# Altium schematic sheet Connectors.SchDoc
size A4; SheetNumber: 2; SheetTotal: 5; SPICEModelCacheIIVRYWVE: <root> / <DocumentId>IIVRYWVE</DocumentId> / <CacheFrame Number="0"> / <Model Name="0805_150080gs75000" Kind="CKT"> / <Text>****** / .subckt 0805_150080GS75000  1  2 / D1 1 2 SMCW / .MODEL SMCW D / + IS=906.98E-12 / + N=4.4982 / + RS=1.5743 / + IKF=518.93E-9 / + CJO=1.0000E-12 / + M=.3333 / + VJ=.75 / + BV=5 / + IBV=10.00E-6 / + TT=5.0000E-9 / .ends</Text> / </Model> / </CacheFrame> / </root>
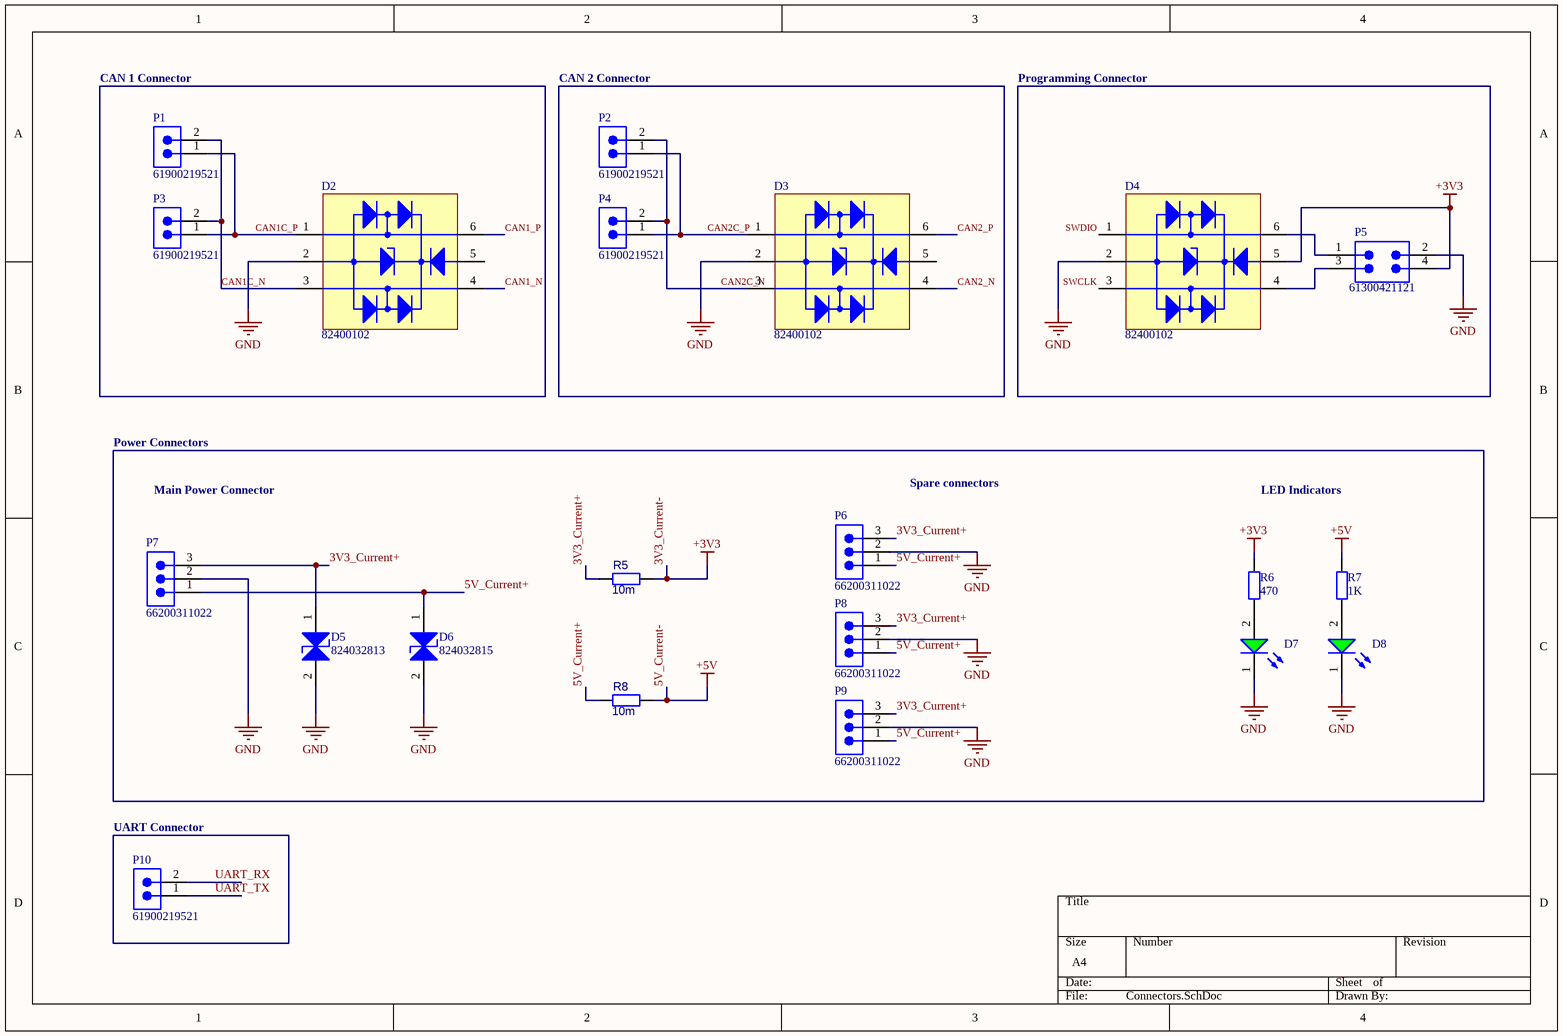
[diagram p0: Connectors.SchDoc]

## Parts
D2  82400102  [WE-TVS_SOT23-6L]
D3  82400102  [WE-TVS_SOT23-6L]
D4  82400102  [WE-TVS_SOT23-6L]
D5  824032813  [WE-TVS_DFN1610-2L]
D6  824032815  [WE-TVS_DFN1610-2L]
D7  150080GS75000  [WL-SMCW_0805_150080xx75000]  (value not drawn)
D8  150080GS75000  [WL-SMCW_0805_150080xx75000]  (value not drawn)
P1  61900219521  [61900219521]
P2  61900219521  [61900219521]
P3  61900219521  [61900219521]
P4  61900219521  [61900219521]
P5  61300421121  [61300421121]
P6  66200311022  [66200311022]
P7  66200311022  [66200311022]
P8  66200311022  [66200311022]
P9  66200311022  [66200311022]
P10  61900219521  [61900219521]
R5  10m  [580070763010-Footprint-1]
R6  value 470  [WRIS-RSKS_0603_Reflow]  (hidden comment: 560112116067)
R7  value 1K  [WRIS-RSKS_0603_Reflow]  (hidden comment: 560112116014)
R8  10m  [580070763010-Footprint-1]

## Blocks framed on the sheet
CAN 1 Connector: D2 P1 P3
CAN 2 Connector: D3 P2 P4
Programming Connector: D4 P5
UART Connector: P10

## Nets
3V3_Current-: D4.5(VDD) P5.4 R5.2 R6.2  [also labelled +3V3]
5V_Current-: R7.2 R8.2  [also labelled +5V]
GND: D2.2(GND) D3.2(GND) D4.2(GND) D5.2(GND) D6.2(GND) D7.1(K) D8.1(K) P5.2 P6.2 P7.2 P8.2 P9.2
3V3_Current+: D5.1(I/O_1) P6.3 P7.3 P8.3 P9.3 R5.1
5V_Current+: D6.1(I/O_1) P6.1 P7.1 P8.1 P9.1 R8.1
CAN1_N: D2.4(I/O_2)
CAN1_P: D2.6(I/O_1)
CAN1C_N: D2.3(I/O_2) P1.2 P3.2
CAN1C_P: D2.1(I/O_1) P1.1 P3.1
CAN2_N: D3.4(I/O_2)
CAN2_P: D3.6(I/O_1)
CAN2C_N: D3.3(I/O_2) P2.2 P4.2
CAN2C_P: D3.1(I/O_1) P2.1 P4.1
SWCLK: D4.3(I/O_2)
SWDIO: D4.1(I/O_1)
UART_RX: P10.2
UART_TX: P10.1
NetD4_4: D4.4(I/O_2) P5.3
NetD4_6: D4.6(I/O_1) P5.1
NetD7_2: D7.2(A) R6.1
NetD8_2: D8.2(A) R7.1

Not connected (* = marked no-connect by the designer): D2 5(VDD); D3 5(VDD)

## Notes on the sheet
- Power Connectors
- Main Power Connector
- Spare connectors
- LED Indicators

## Library data of the parts
D2-D4 = CMP-004-00017-1: WE-TVS TVS Diode – High Speed Series, SOT23-6L, 2+1 Channel, 5V, 2pF; Manufacturer: Wurth Elektronik; Polarity: Unidirectional; Channel ESD Clamping Voltage: 10V; ESD Air Discharge Capability: 15kV; (Reverse) Peak Pulse Current: 7A; (Reverse) Breakdown Voltage: 6V; Channel Reverse Leakage Current: 1uA; ESD Contact Discharge Capability: 8kV; Source: WE-TVS.SchLib; Component Type: Standard; Packaging: Tape and Reel; Height: 1.45mm; Pins: 6; Match Code: WE-TVS; Case/Package: SOT23-6L; Mount: Surface Mount; Channel Operating Voltage: 5V; ComponentLink1Description: Website Link; ComponentLink2URL: https://www.we-online.com/redexpert/spec/82400102?ad; Category: ESD Protection; Channel Input Capacitance: 2pF; Operating Temperature Min: -40°C; ComponentLink1URL: https://www.we-online.com/redexpert/article/82400102?ad; Length: 2.9mm; Width: 2.8mm; Manufacturer Part Number: 82400102; Design Item ID: 82400102; ComponentLink2Description: Datasheet Link; Operating Temperature Max: 125°C; Number of Channels: 2+1
D5 = CMP-03913-133963840-1: 824032813 Tvs Diode, Bidir, 3.3V, Dfn1610 Rohs Compliant: Yes; Width: 1mm; NexarPartId: 133963840; Min Operating Temperature: -55°C; Max Operating Temperature: 125°C; Height: 500µm; Length: 1.6mm; RoHS: Compliant
D6 = CMP-03913-133963841-1: 824032815 Tvs Diode, Bidir, 5V, Dfn1610 Rohs Compliant: Yes; Min Operating Temperature: -55°C; Width: 1mm; NexarPartId: 133963841; Length: 1.6mm; RoHS: Compliant; Max Operating Temperature: 85°C; Height: 500µm
D7 D8 = CMP-004-00452-1: WL-SMCW Mono-color Chip LED Waterclear, SMT, size 0805, Green, 3.2V, 140°; Manufacturer: Wurth Elektronik; Dominant Wavelength: 525nm; Chip Technology: InGaN; Luminous Intensity: 450mcd; Peak Wavelength: 515nm; Viewing Angle: 140°; Source: WL-SMCW.SchLib; Category: Signal LEDs; Design Item ID: 150080GS75000; ComponentLink1URL: https://www.we-online.com/redexpert/article/150080GS75000?ad; Pins: 2; Emitting Color: Green; Mount: Surface Mount; ComponentLink2URL: https://www.we-online.com/redexpert/spec/150080GS75000?ad; Match Code: WL-SMCW; ComponentLink1Description: Website Link; Operating Temperature Max: 85°C; Case/Package: 0805; Manufacturer Part Number: 150080GS75000; Forward Voltage: 3.2V; Operating Temperature Min: -40°C; Component Type: Standard; Height: 0.7mm; Length: 2mm; Width: 1.25mm; Packaging: Tape and Reel; ComponentLink2Description: Datasheet Link
P1-P4 P10 = CMP-002-00288-1: WR-WTB THT Male Right Angled Top Locking Header, pitch 2.54mm, 2pins; Manufacturer: Wurth Elektronik; Working Voltage: 250VAC; Contact Resistance: 20mOhm; Rated Current: 3A; Withstanding Voltage: 1000VAC; Number of Rows: 1; Length: 5.08mm; ComponentLink1URL: https://www.we-online.com/redexpert/article/61900219521?ad; Mount: Through Hole; ComponentLink2Description: Datasheet Link; Pins: 2; Width: 12.47mm; Height: 5.8mm; Component Type: Standard; Orientation: Right Angled Top Locking; Match Code: WR-WTB; Design Item ID: 61900219521; Pitch: 2.54mm; ComponentLink2URL: https://www.we-online.com/redexpert/spec/61900219521?ad; Manufacturer Part Number: 61900219521; ComponentLink1Description: Website Link; Packaging: Bag; Gender: Male; Pin Count: 2; Operating Temperature Max: 105°C; Source: WR-WTB.SchLib; Category: Wire-to-Board Connectors; Operating Temperature Min: -40°C
P5 = CMP-002-00747-2: Board Connector, 4 Contact(s), 2 Row(s), Male, Straight, 0.1 inch Pitch, Solder Terminal, Black Insulator, Plug; RoHS Compliant: Yes; Min Operating Temperature: -40°C; Mounting Technology: Board; Connector Type: BOARD CONNECTOR; Max Operating Temperature: 125°C
P6-P9 = CMP-1502-00462-2: NexarPartId: 29930352; Insulation Resistance: 1GΩ; Operating Supply Voltage: 250V; Current Rating: 5A; Pitch: 3mm; Contact Resistance: 10mΩ; Gender: Male; Length: 12.65mm; Number of Pins: 3; Max Operating Temperature: 105°C; Min Operating Temperature: -40°C; Lead Pitch: 3mm; RoHS: Compliant; Contact Plating: Tin
R5 R8 = CMP-009-00124-2: Res, 0R01, 1%, 2W, Metal Foil, 0612 Rohs Compliant: Yes
R6 = CMP-009-00390-1: WRIS-RSKS Thick Film Resistor, size 0603, 470Ohm, 100mW; Manufacturer: Wurth Elektronik; Limiting Element Voltage: 75V; Temperature Coefficient of Resistance Max: 100ppm/°C; Resistance Tolerance: +/-1%; Temperature Coefficient of Resistance Min: -100ppm/°C; Rated Power: 100mW; Height: 0.45mm; ComponentLink2Description: Datasheet Link; Component Type: Standard; ComponentLink1URL: https://www.we-online.com/redexpert/article/560112116067?ad; ComponentLink1Description: Website Link; Operating Temperature Min: -55°C; Match Code: WRIS-RSKS; Mount: Surface Mount; Case/Package: 0603; Source: WRIS-RSKS.SchLib; Length: 1.6mm; Category: Thick Film Resistors; Operating Temperature Max: 155°C; Pins: 2; Packaging: Tape and Reel; Manufacturer Part Number: 560112116067; ComponentLink2URL: https://www.we-online.com/redexpert/spec/560112116067?ad; Width: 0.8mm; Design Item ID: 560112116067
R7 = CMP-009-00337-1: WRIS-RSKS Thick Film Resistor, size 0603, 1000Ohm, 100mW; Manufacturer: Wurth Elektronik; Resistance Tolerance: +/-1%; Limiting Element Voltage: 75V; Temperature Coefficient of Resistance Min: -100ppm/°C; Temperature Coefficient of Resistance Max: 100ppm/°C; Mount: Surface Mount; Rated Power: 100mW; Packaging: Tape and Reel; Case/Package: 0603; ComponentLink1URL: https://www.we-online.com/redexpert/article/560112116014?ad; Height: 0.45mm; Manufacturer Part Number: 560112116014; ComponentLink1Description: Website Link; ComponentLink2URL: https://www.we-online.com/redexpert/spec/560112116014?ad; Source: WRIS-RSKS.SchLib; Operating Temperature Min: -55°C; Width: 0.8mm; Match Code: WRIS-RSKS; Design Item ID: 560112116014; ComponentLink2Description: Datasheet Link; Category: Thick Film Resistors; Operating Temperature Max: 155°C; Component Type: Standard; Length: 1.6mm; Pins: 2